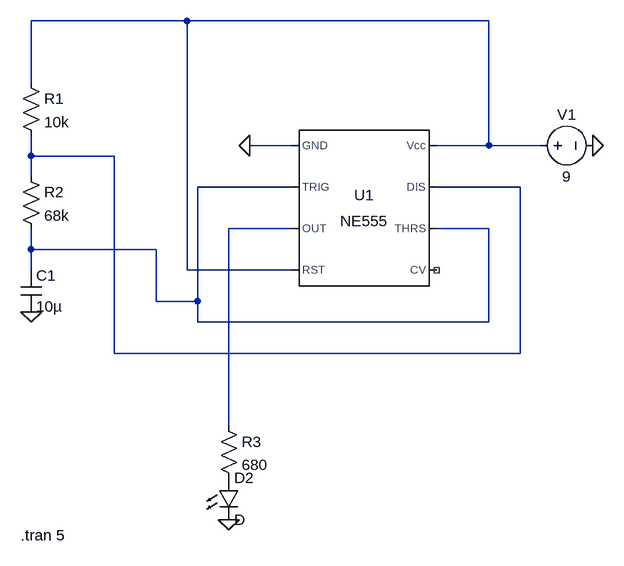
[diagram p0: schematic ne555Astabil.asc]
ne555Astabil.asc, the LTspice schematic file:
Version 4.1
SHEET 1 880 680
WIRE -128 -160 -368 -160
WIRE 336 -160 -128 -160
WIRE -368 -64 -368 -160
WIRE 32 32 -32 32
WIRE 336 32 336 -160
WIRE 336 32 256 32
WIRE 416 32 336 32
WIRE -368 48 -368 16
WIRE -240 48 -368 48
WIRE -368 80 -368 48
WIRE 32 96 -112 96
WIRE 384 96 256 96
WIRE 32 160 -64 160
WIRE 336 160 256 160
WIRE -368 192 -368 160
WIRE -176 192 -368 192
WIRE -368 224 -368 192
WIRE -128 224 -128 -160
WIRE 32 224 -128 224
WIRE -176 272 -176 192
WIRE -112 272 -112 96
WIRE -112 272 -176 272
WIRE -112 304 -112 272
WIRE 336 304 336 160
WIRE 336 304 -112 304
WIRE -240 352 -240 48
WIRE 384 352 384 96
WIRE 384 352 -240 352
WIRE -64 464 -64 160
FLAG -32 32 0
FLAG 496 32 0
FLAG -368 288 0
FLAG -64 608 0
SYMBOL Misc\\NE555 144 128 R0
SYMATTR InstName U1
SYMBOL voltage 400 32 R270
WINDOW 0 32 56 VTop 2
WINDOW 3 -32 56 VBottom 2
WINDOW 123 0 0 Left 0
WINDOW 39 0 0 Left 0
SYMATTR InstName V1
SYMATTR Value 9
SYMBOL res -384 -80 R0
SYMATTR InstName R1
SYMATTR Value 10k
SYMBOL res -384 64 R0
SYMATTR InstName R2
SYMATTR Value 68k
SYMBOL cap -384 224 R0
SYMATTR InstName C1
SYMATTR Value 10µ
SYMBOL res -80 448 R0
SYMATTR InstName R3
SYMATTR Value 680
SYMBOL LED -80 544 R0
SYMATTR InstName D2
TEXT -384 632 Left 2 !.tran 5

The netlist it stands for:
* ne555Astabil.asc
X§U1 0 N003 N004 N001 NC_01 N003 N002 N001 NE555  ; pins GND TRIG OUT RST CV THRS DIS Vcc
V1 N001 0 9
R1 N001 N002 10k
R2 N002 N003 68k
C1 N003 0 10µ
R3 N004 P001 680
D2 P001 0 D
.model D D
.lib standard.dio
.tran 5
.lib NE555.sub
.backanno
.end